# EAGLE schematic v2 (EAGLE 9.6.2)
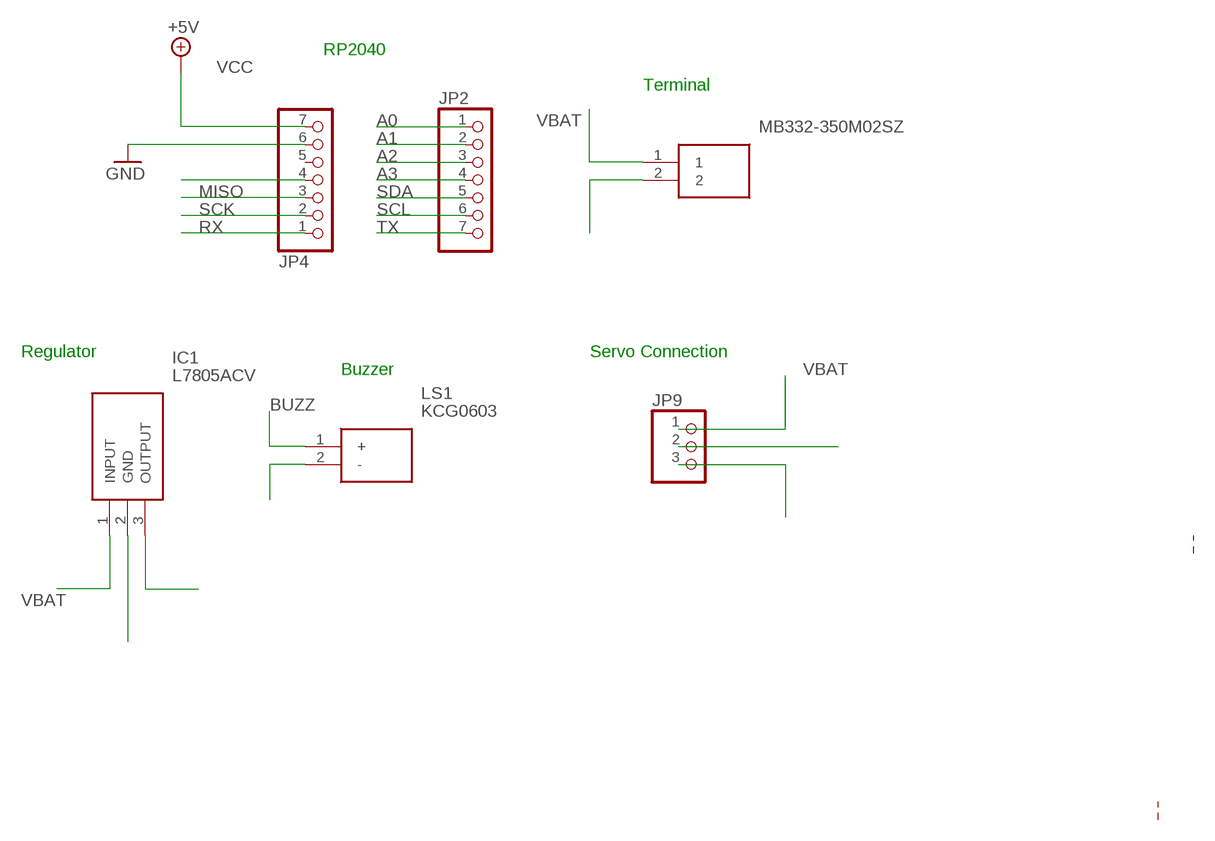
[diagram p0: schematic, sheet 1]

## Parts
IC1  L7805ACV  [TO255P460X1020X2008-3P]
JP2  HEADER-1X7  [1X07_OVAL]
JP4  HEADER-1X7  [1X07_OVAL]
JP9  PINHD-1X3  [1X03]
LS1  KCG0603  [CAPPRD320W70D660H400]
VBAT  MB332-350M02SZ  [MB332350M02SZ]

## Nets
A0: JP2.1
A1: JP2.2
A2: JP2.3
A3: JP2.4
BUZZ: LS1.1(+)
GND [highpower]: JP4.6
MISO: JP4.3
MOSI: JP4.4
N$2: IC1.2(GND)
N$3: IC1.3(OUTPUT)
N$5: LS1.2(-)
N$7: JP9.2
N$8: JP9.3
N$10: VBAT.2
RX: JP4.1
SCK: JP4.2
SCL: JP2.6
SDA: JP2.5
TX: JP2.7
VBAT: IC1.1(INPUT) JP9.1 VBAT.1
VCC [highpower]: JP4.7 ; supply symbol labelled +5V
Unconnected: JP4.5

## Notes on the sheet
- RP2040
- Terminal
- Regulator | Servo Connection
- Buzzer

## Library data of the parts
IC1 = SamacSys_Parts:L7805ACV: Linear voltage regulator,L7805ACV 5V 1A STMicroelectronics L7805ACV, Single Linear Voltage Regulator, 1A 5 V, 2%, 3-Pin TO-220 Source: Datasheet <http://uk.rs-online.com/web/p/products/2988508P>; ALLIED_NUMBER: 70013701; DESCRIPTION: Linear voltage regulator,L7805ACV 5V 1A STMicroelectronics L7805ACV, Single Linear Voltage Regulator, 1A 5 V, 2%, 3-Pin TO-220; HEIGHT: 4.6mm; MANUFACTURER_NAME: STMicroelectronics; MANUFACTURER_PART_NUMBER: L7805ACV; RS_PART_NUMBER: 2988508P; RS_PRICE-STOCK: http://uk.rs-online.com/web/p/products/2988508P
JP2 JP4 = microbuilder:HEADER-1X7: PIN HEADER
JP9 = pinhead:PINHD-1X3: PIN HEADER
LS1 = SamacSys_Parts:KCG0603: RS PRO 4V Electromagnetic Buzzer, 80dB Source: Datasheet; DESCRIPTION: RS PRO 4V Electromagnetic Buzzer, 80dB; HEIGHT: 4mm; MANUFACTURER_NAME: RS Components; MANUFACTURER_PART_NUMBER: KCG0603
VBAT = SamacSys_Parts:MB332-350M02SZ: RS PRO 3.5mm Pitch Straight, PCB Terminal Block, Through Hole, 2 Way Source: Datasheet; DESCRIPTION: RS PRO 3.5mm Pitch Straight, PCB Terminal Block, Through Hole, 2 Way; HEIGHT: 12.76mm; MANUFACTURER_NAME: RS Components; MANUFACTURER_PART_NUMBER: MB332-350M02SZ; RS_PART_NUMBER: 7901149; RS_PRICE-STOCK: https://uk.rs-online.com/web/p/products/7901149

## Net classes
1 highpower: width 0.305 mm, drill 0.483 mm
2 lowpower: width 0.305 mm, drill 0.483 mm